# Altium schematic sheet PAGE06_POWER SWITCHES &.SchDoc
size 391 x 287 mm
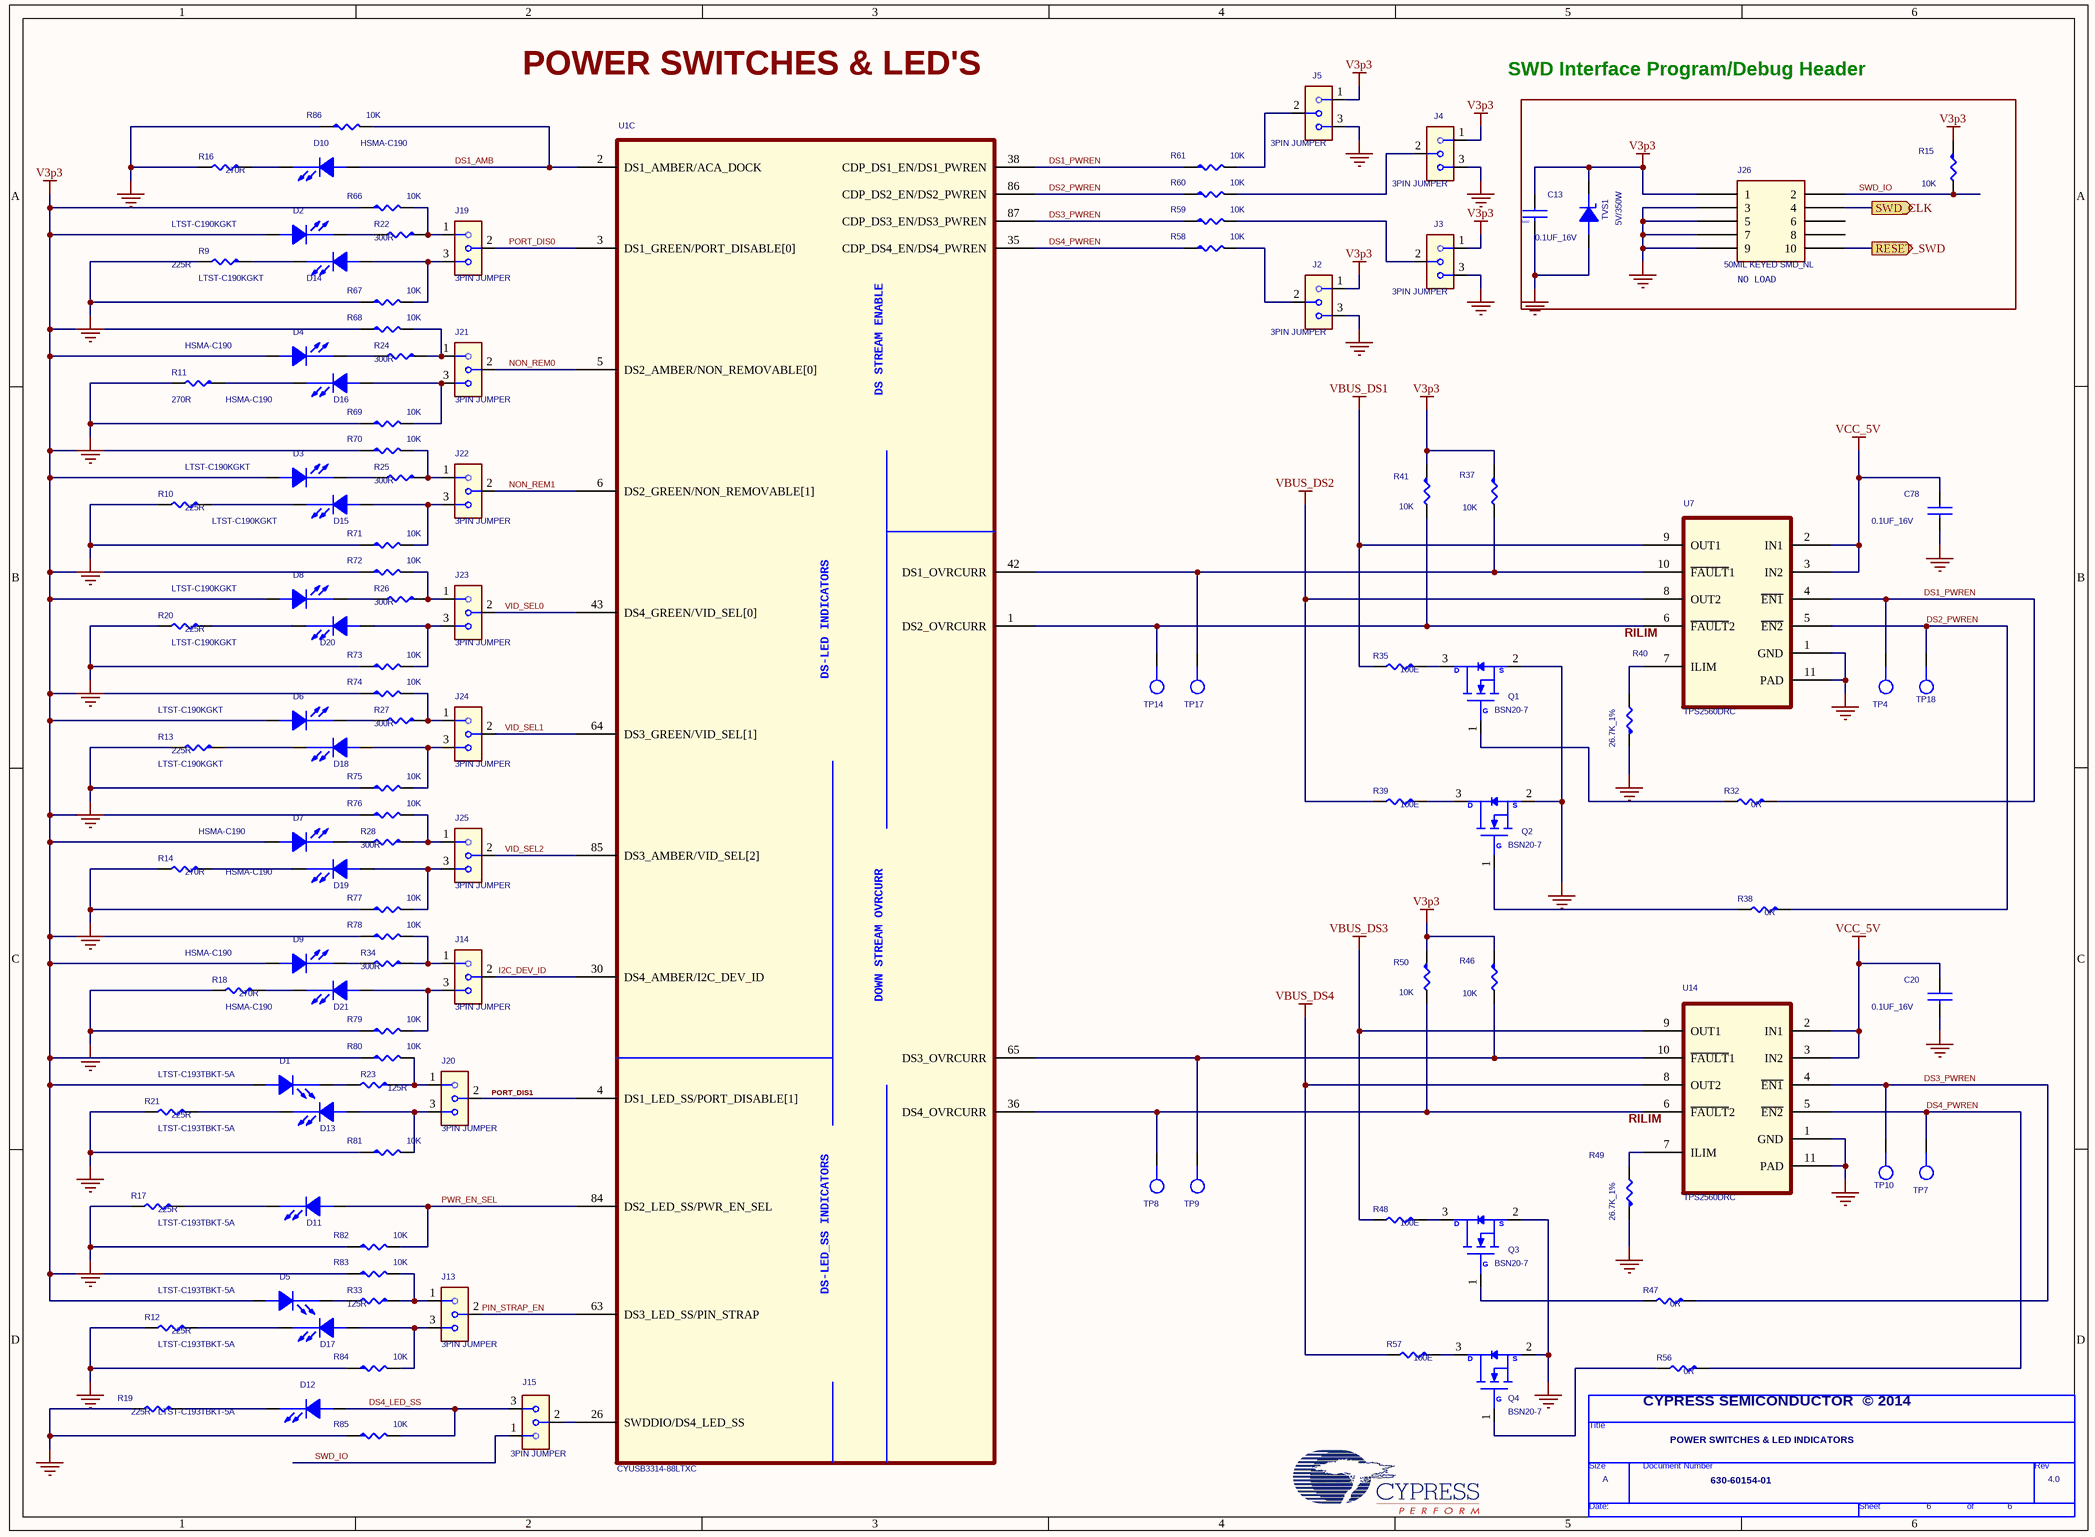
[diagram p0: PAGE06_POWER SWITCHES &.SchDoc]

## Parts
*  Page Count: 6  Page Size: A  Title: POWER SWITCHES & LED INDICATORS  RevCode: 4.0  Doc: 630-60154-01  (hidden comment: TitleBlock0)  (graphical)
C13  0.1UF_16V  [CAPC1005X55M]
C20  0.1UF_16V  [CAPC1005X56M]
C78  0.1UF_16V  [CAPC1005X56M]
D1  LTST-C193TBKT-5A  [LEDC1608X35M]
D2  LTST-C190KGKT  [LEDC1608X80M]
D3  LTST-C190KGKT  [LEDC1608X80M]
D4  HSMA-C190  [LEDC1608X80M]
D5  LTST-C193TBKT-5A  [LEDC1608X35M]
D6  LTST-C190KGKT  [LEDC1608X80M]
D7  HSMA-C190  [LEDC1608X80M]
D8  LTST-C190KGKT  [LEDC1608X80M]
D9  HSMA-C190  [LEDC1608X80M]
D10  HSMA-C190  [LEDC1608X80M]
D11  LTST-C193TBKT-5A  [LEDC1608X35M]
D12  LTST-C193TBKT-5A  [LEDC1608X35M]
D13  LTST-C193TBKT-5A  [LEDC1608X35M]
D14  LTST-C190KGKT  [LEDC1608X80M]
D15  LTST-C190KGKT  [LEDC1608X80M]
D16  HSMA-C190  [LEDC1608X80M]
D17  LTST-C193TBKT-5A  [LEDC1608X35M]
D18  LTST-C190KGKT  [LEDC1608X80M]
D19  HSMA-C190  [LEDC1608X80M]
D20  LTST-C190KGKT  [LEDC1608X80M]
D21  HSMA-C190  [LEDC1608X80M]
J2  3PIN JUMPER  [TE_3-644456-3]
J3  3PIN JUMPER  [TE_3-644456-3]
J4  3PIN JUMPER  [TE_3-644456-3]
J5  3PIN JUMPER  [TE_3-644456-3]
J13  3PIN JUMPER  [TE_3-644456-3]
J14  3PIN JUMPER  [TE_3-644456-3]
J15  3PIN JUMPER  [TE_3-644456-3]
J19  3PIN JUMPER  [TE_3-644456-3]
J20  3PIN JUMPER  [TE_3-644456-3]
J21  3PIN JUMPER  [TE_3-644456-3]
J22  3PIN JUMPER  [TE_3-644456-3]
J23  3PIN JUMPER  [TE_3-644456-3]
J24  3PIN JUMPER  [TE_3-644456-3]
J25  3PIN JUMPER  [TE_3-644456-3]
J26  50MIL KEYED SMD_NL  [SAMTEC_FTSH-105-01-L-DV-K]
Q1  BSN20-7  [SOT92P240X110-3M]
Q2  BSN20-7  [SOT92P240X110-3M]
Q3  BSN20-7  [SOT92P240X110-3M]
Q4  BSN20-7  [SOT92P240X110-3M]
R9  225R  [RESC1608X50M]
R10  225R  [RESC1608X50M]
R11  270R  [RESC1608X50M]
R12  225R  [RESC1608X50M]
R13  225R  [RESC1608X50M]
R14  270R  [RESC1608X50M]
R15  10K  [RESC1005X40M]
R16  270R  [RESC1608X50M]
R17  225R  [RESC1608X50M]
R18  270R  [RESC1608X50M]
R19  225R  [RESC1608X50M]
R20  225R  [RESC1608X50M]
R21  225R  [RESC1608X50M]
R22  300R  [RESC2012X65M]
R23  125R  [RESC2012X65M]
R24  300R  [RESC2012X65M]
R25  300R  [RESC2012X65M]
R26  300R  [RESC2012X65M]
R27  300R  [RESC2012X65M]
R28  300R  [RESC2012X65M]
R32  0R  [RESC1608X50M]
R33  125R  [RESC2012X65M]
R34  300R  [RESC2012X65M]
R35  100E  [RESC1608X50M]
R37  10K  [RESC1005X40M]
R38  0R  [RESC1608X50M]
R39  100E  [RESC1608X50M]
R40  26.7K_1%  [RESC1005X40M]
R41  10K  [RESC1005X40M]
R46  10K  [RESC1005X40M]
R47  0R  [RESC1608X50M]
R48  100E  [RESC1608X50M]
R49  26.7K_1%  [RESC1005X40M]
R50  10K  [RESC1005X40M]
R56  0R  [RESC1608X50M]
R57  100E  [RESC1608X50M]
R58  10K  [RESC1005X40M]
R59  10K  [RESC1005X40M]
R60  10K  [RESC1005X40M]
R61  10K  [RESC1005X40M]
R66  10K  [RESC1005X40M]
R67  10K  [RESC1005X40M]
R68  10K  [RESC1005X40M]
R69  10K  [RESC1005X40M]
R70  10K  [RESC1005X40M]
R71  10K  [RESC1005X40M]
R72  10K  [RESC1005X40M]
R73  10K  [RESC1005X40M]
R74  10K  [RESC1005X40M]
R75  10K  [RESC1005X40M]
R76  10K  [RESC1005X40M]
R77  10K  [RESC1005X40M]
R78  10K  [RESC1005X40M]
R79  10K  [RESC1005X40M]
R80  10K  [RESC1005X40M]
R81  10K  [RESC1005X40M]
R82  10K  [RESC1005X40M]
R83  10K  [RESC1005X40M]
R84  10K  [RESC1005X40M]
R85  10K  [RESC1005X40M]
R86  10K  [RESC1005X40M]
TP4  TEST POINT  [TP25C50]  (value not drawn)
TP7  TEST POINT  [TP25C50]  (value not drawn)
TP8  TEST POINT  [TP25C50]  (value not drawn)
TP9  TP_YEL  [KEYSTONE_5000]  (value not drawn)
TP10  TP_YEL  [KEYSTONE_5000]  (value not drawn)
TP14  TEST POINT  [TP25C50]  (value not drawn)
TP17  TP_YEL  [KEYSTONE_5000]  (value not drawn)
TP18  TP_YEL  [KEYSTONE_5000]  (value not drawn)
TVS1  5V/350W  [SOD2513X120M]
U1  CYUSB3314-88LTXC  [QFN40P1000X1000X100-89M]  (part C of 3)
U7  TPS2560DRC  [SON50P300X300X100-11M]
U14  TPS2560DRC  [SON50P300X300X100-11M]

## Blocks framed on the sheet
NO LOAD: C13 J26 R15 TVS1

## Ports
RESET_SWD (out), SWD_CLK (out)

## Nets
GND: C13.2 C20.2 C78.2 J2.3 J3.3 J4.3 J5.3 J26.3 J26.5 J26.7 J26.9 Q1.2(S) Q2.2(S) Q3.2(S) Q4.2(S) R9.2 R10.2 R11.2 R12.2 R13.2 R14.2 R16.2 R17.2 R18.2 R19.2 R20.2 R21.2 R40.1 R49.1 R67.1 R69.1 R71.1 R73.1 R75.1 R77.1 R79.1 R81.1 R82.1 R84.1 R85.1 R86.1 TVS1.2(A) U7.1(GND) U7.11(PAD) U14.1(GND) U14.11(PAD)
V3p3: C13.1 D1.1(ANODE) D2.1(ANODE) D3.1(ANODE) D4.1(ANODE) D5.1(ANODE) D6.1(ANODE) D7.1(ANODE) D8.1(ANODE) D9.1(ANODE) J2.1 J3.1 J4.1 J5.1 J26.1 R15.1 R37.1 R41.1 R46.1 R50.1 R66.1 R68.1 R70.1 R72.1 R74.1 R76.1 R78.1 R80.1 R83.1 TVS1.1(K)
VBUS_DS1: R35.2 U7.9(OUT1)
VBUS_DS2: R39.2 U7.8(OUT2)
VBUS_DS3: R48.2 U14.9(OUT1)
VBUS_DS4: R57.2 U14.8(OUT2)
VCC_5V: C20.1 C78.1 U7.2(IN1) U7.3(IN2) U14.2(IN1) U14.3(IN2)
DS1_AMB: D10.1(ANODE) R86.2 U1.2(DS1_AMBER/ACA_DOCK)
DS1_PWREN: R32.1 R61.1 TP4.1(TP) U1.38(CDP_DS1_EN/DS1_PWREN) U7.4(~{EN1})
DS2_PWREN: R38.1 R60.1 TP18.1(TP) U1.86(CDP_DS2_EN/DS2_PWREN) U7.5(~{EN2})
DS3_PWREN: R47.1 R59.1 TP10.1(TP) U1.87(CDP_DS3_EN/DS3_PWREN) U14.4(~{EN1})
DS4_LED_SS: D12.1(ANODE) J15.3 R85.2
DS4_PWREN: R56.1 R58.1 TP7.1(TP) U1.35(CDP_DS4_EN/DS4_PWREN) U14.5(~{EN2})
I2C_DEV_ID: J14.2 U1.30(DS4_AMBER/I2C_DEV_ID)
NON_REM0: J21.2 U1.5(DS2_AMBER/NON_REMOVABLE[0])
NON_REM1: J22.2 U1.6(DS2_GREEN/NON_REMOVABLE[1])
PIN_STRAP_EN: J13.2 U1.63(DS3_LED_SS/PIN_STRAP)
PORT_DIS0: J19.2 U1.3(DS1_GREEN/PORT_DISABLE[0])
PORT_DIS1: J20.2 U1.4(DS1_LED_SS/PORT_DISABLE[1])
PWR_EN_SEL: D11.1(ANODE) R82.2 U1.84(DS2_LED_SS/PWR_EN_SEL)
RESET_SWD: J26.10 ; port RESET_SWD
SWD_CLK: J26.4 ; port SWD_CLK
SWD_IO: J15.1 J26.2 R15.2
VID_SEL0: J23.2 U1.43(DS4_GREEN/VID_SEL[0])
VID_SEL1: J24.2 U1.64(DS3_GREEN/VID_SEL[1])
VID_SEL2: J25.2 U1.85(DS3_AMBER/VID_SEL[2])
NetD1_2: D1.2(CATHODE) R23.2
NetD2_2: D2.2(CATHODE) R22.2
NetD3_2: D3.2(CATHODE) R25.2
NetD4_2: D4.2(CATHODE) R24.2
NetD5_2: D5.2(CATHODE) R33.2
NetD6_2: D6.2(CATHODE) R27.2
NetD7_2: D7.2(CATHODE) R28.2
NetD8_2: D8.2(CATHODE) R26.2
NetD9_2: D9.2(CATHODE) R34.2
NetD10_2: D10.2(CATHODE) R16.1
NetD11_2: D11.2(CATHODE) R17.1
NetD12_2: D12.2(CATHODE) R19.1
NetD13_1: D13.1(ANODE) J20.3 R81.2
NetD13_2: D13.2(CATHODE) R21.1
NetD14_1: D14.1(ANODE) J19.3 R67.2
NetD14_2: D14.2(CATHODE) R9.1
NetD15_1: D15.1(ANODE) J22.3 R71.2
NetD15_2: D15.2(CATHODE) R10.1
NetD16_1: D16.1(ANODE) J21.3 R69.2
NetD16_2: D16.2(CATHODE) R11.1
NetD17_1: D17.1(ANODE) J13.3 R84.2
NetD17_2: D17.2(CATHODE) R12.1
NetD18_1: D18.1(ANODE) J24.3 R75.2
NetD18_2: D18.2(CATHODE) R13.1
NetD19_1: D19.1(ANODE) J25.3 R77.2
NetD19_2: D19.2(CATHODE) R14.1
NetD20_1: D20.1(ANODE) J23.3 R73.2
NetD20_2: D20.2(CATHODE) R20.1
NetD21_1: D21.1(ANODE) J14.3 R79.2
NetD21_2: D21.2(CATHODE) R18.1
NetJ2_2: J2.2 R58.2
NetJ3_2: J3.2 R59.2
NetJ4_2: J4.2 R60.2
NetJ5_2: J5.2 R61.2
NetJ13_1: J13.1 R33.1 R83.2
NetJ14_1: J14.1 R34.1 R78.2
NetJ15_2: J15.2 U1.26(SWDDIO/DS4_LED_SS)
NetJ19_1: J19.1 R22.1 R66.2
NetJ20_1: J20.1 R23.1 R80.2
NetJ21_1: J21.1 R24.1 R68.2
NetJ22_1: J22.1 R25.1 R70.2
NetJ23_1: J23.1 R26.1 R72.2
NetJ24_1: J24.1 R27.1 R74.2
NetJ25_1: J25.1 R28.1 R76.2
NetQ1_1: Q1.1(G) R32.2
NetQ1_3: Q1.3(D) R35.1
NetQ2_1: Q2.1(G) R38.2
NetQ2_3: Q2.3(D) R39.1
NetQ3_1: Q3.1(G) R47.2
NetQ3_3: Q3.3(D) R48.1
NetQ4_1: Q4.1(G) R56.2
NetQ4_3: Q4.3(D) R57.1
NetR37_2: R37.2 TP17.1(TP) U1.42(DS1_OVRCURR) U7.10(~{FAULT}1)
NetR40_2: R40.2 U7.7(ILIM)
NetR41_2: R41.2 TP14.1(TP) U1.1(DS2_OVRCURR) U7.6(~{FAULT}2)
NetR46_2: R46.2 TP9.1(TP) U1.65(DS3_OVRCURR) U14.10(~{FAULT}1)
NetR49_2: R49.2 U14.7(ILIM)
NetR50_2: R50.2 TP8.1(TP) U1.36(DS4_OVRCURR) U14.6(~{FAULT}2)

Not connected (* = marked no-connect by the designer): J26 6 8

## Notes on the sheet
- POWER SWITCHES & LED'S
- SWD Interface Program/Debug Header
- (near U7) RILIM
- (near U14) RILIM
- (near R56) CYPRESS SEMICONDUCTOR  © 2014
- (in symbol 0.1 uFd 0402) 0402
- (in symbol CYUSB3314-88LTXC_2, part C) DS STREAM ENABLE; DS-LED INDICATORS; DOWN STREAM OVRCURR; DS-LED_SS INDICATORS
- (in symbol TitleBlock0) Title; Size; Document Number; Rev; Date:; Sheet; of

## Library data of the parts
C13 = 0.1 uFd 0402: CAP .1UF 16V CERAMIC Y5V 0402; Cy_part#: 730R-10010; Manufacturer: Panasonic - ECG; Part Number: ECJ-0EF1C104Z; DEVICE: 0p1uFd_0402; CLASS: DISCRETE; ALT_SYMBOLS: C-CC0402_A; VOLTAGE: 16V; Created by: SNF
C20 C78 = CAPACITOR NON-POL: Manufacturer: *; Part Number: *
D1-D21 = LED: Manufacturer: *
  D1 D5 D11-D13 D17: Part Number: LTST-C193TBKT-5A
  D2 D3 D6 D8 D14 D15 D18 D20: Part Number: LTST-C190KGKT
  D4 D7 D9 D10 D16 D19 D21: Part Number: HSMA-C190
J2 J4 J14 J23 J25 = 3PIN JUM: CONN HEADER VERT 3POS .100 TIN; Manufacturer: Tyco Electronics; Part Number: 3-644456-3; Type: Single Row,3Pin Header
J3 J5 J13 J15 J19-J22 J24 = 3PIN JUM: CONN HEADER VERT 3POS .100 TIN; Part Number: 3-644456-3; Manufacturer: Tyco Electronics; Type: Single Row,3Pin Header
J26 = 10 Pin Header 50mil Keyed SMD: CONN HEADER 10 PIN 50MIL KEYED SMD; Part Number: FTSH-105-01-L-DV-K; Manufacturer: Samtec; Cy_part#: 420R-14312; CLASS: IO; Last Edit By: SNF; DEVICE: HDR5x2x50KS
Q1-Q4 = BSN20-7: MOSFET N-CH 50V 500MA SOT23; Manufacturer: Diodes Inc; PSpiceTemplate: X^@REFDES %D %G %S @MODEL; Part Number: BSN20-7
R9-R14 R16-R28 R32-R35 R38 R39 R47 R48 R56 R57 = R_Dup1: Lead Free: YES
  R9: Value: 225R
  R11 R16: Value: 270R
R15 R37 R50 R58-R61 R66 R67 R70 R71 R73-R77 R79 R80 R82-R86 = R_Dup1: RES 10.0K OHM 1/10W 1% 0603 SMD; Manufacturer: Panasonic - ECG; Part Number: ERJ-3EKF1002V; Lead Free: YES
R40 = R_Dup1: RES 28.0K OHM 1/10W 1% 0402 SMD; Manufacturer: Panasonic; Part Number: ERJ-2RKF2802X; Manufacturer Part Num: R5110402; Tolerance: 1%
R41 R46 R68 R69 R72 R78 R81 = R_Dup1: RES 10.0K OHM 1/10W 1% 0603 SMD; Part Number: ERJ-3EKF1002V; Manufacturer: Panasonic - ECG; Lead Free: YES
R49 = R_Dup1: RES 28.0K OHM 1/10W 1% 0402 SMD; Part Number: ERJ-2RKF2802X; Manufacturer Part Num: R5110402; Manufacturer: Panasonic; Tolerance: 1%
TP4 TP7 TP8 TP14 = TP
TP9 TP17 = TP: TEST POINT PC MINI .040"D RED; Part Number: 5000; Manufacturer: Keystone
TP10 TP18 = TP: TEST POINT PC MINI .040"D RED; Manufacturer: Keystone; Part Number: 5000
TVS1 = TVS 5V SOD-323_0: TVS UNIDIR 350W 5V SOD-323; Part Number: SD05.TCT; Manufacturer: Dioded Inc.; CLASS: DISCRETE; DEVICE: SD05-7; LastEditBy: gir
U1 = CYUSB3314-88LTXC_2: Manufacturer: *; Part Number: CYUSB3314-88LTXC
* = TitleBlock0: Page Number: 6; Page Create Date: March  8, 1995
U7 U14 = TPS2560DRC: Part Number: TPS2560DRC; Manufacturer: *